# EasyEDA Pro project ACS DIN Switch.eprj

# Schematic Schematic1
Board Name: V3.0.0 Main Board; Create Date: 2026-03-01; Page Name: P1; Project Name: ACS DIN Switch; Schematic Name: Schematic1; Update Date: 2026-04-05; Company: EasyEDA.com; Page Size: A4; Version: V1.0
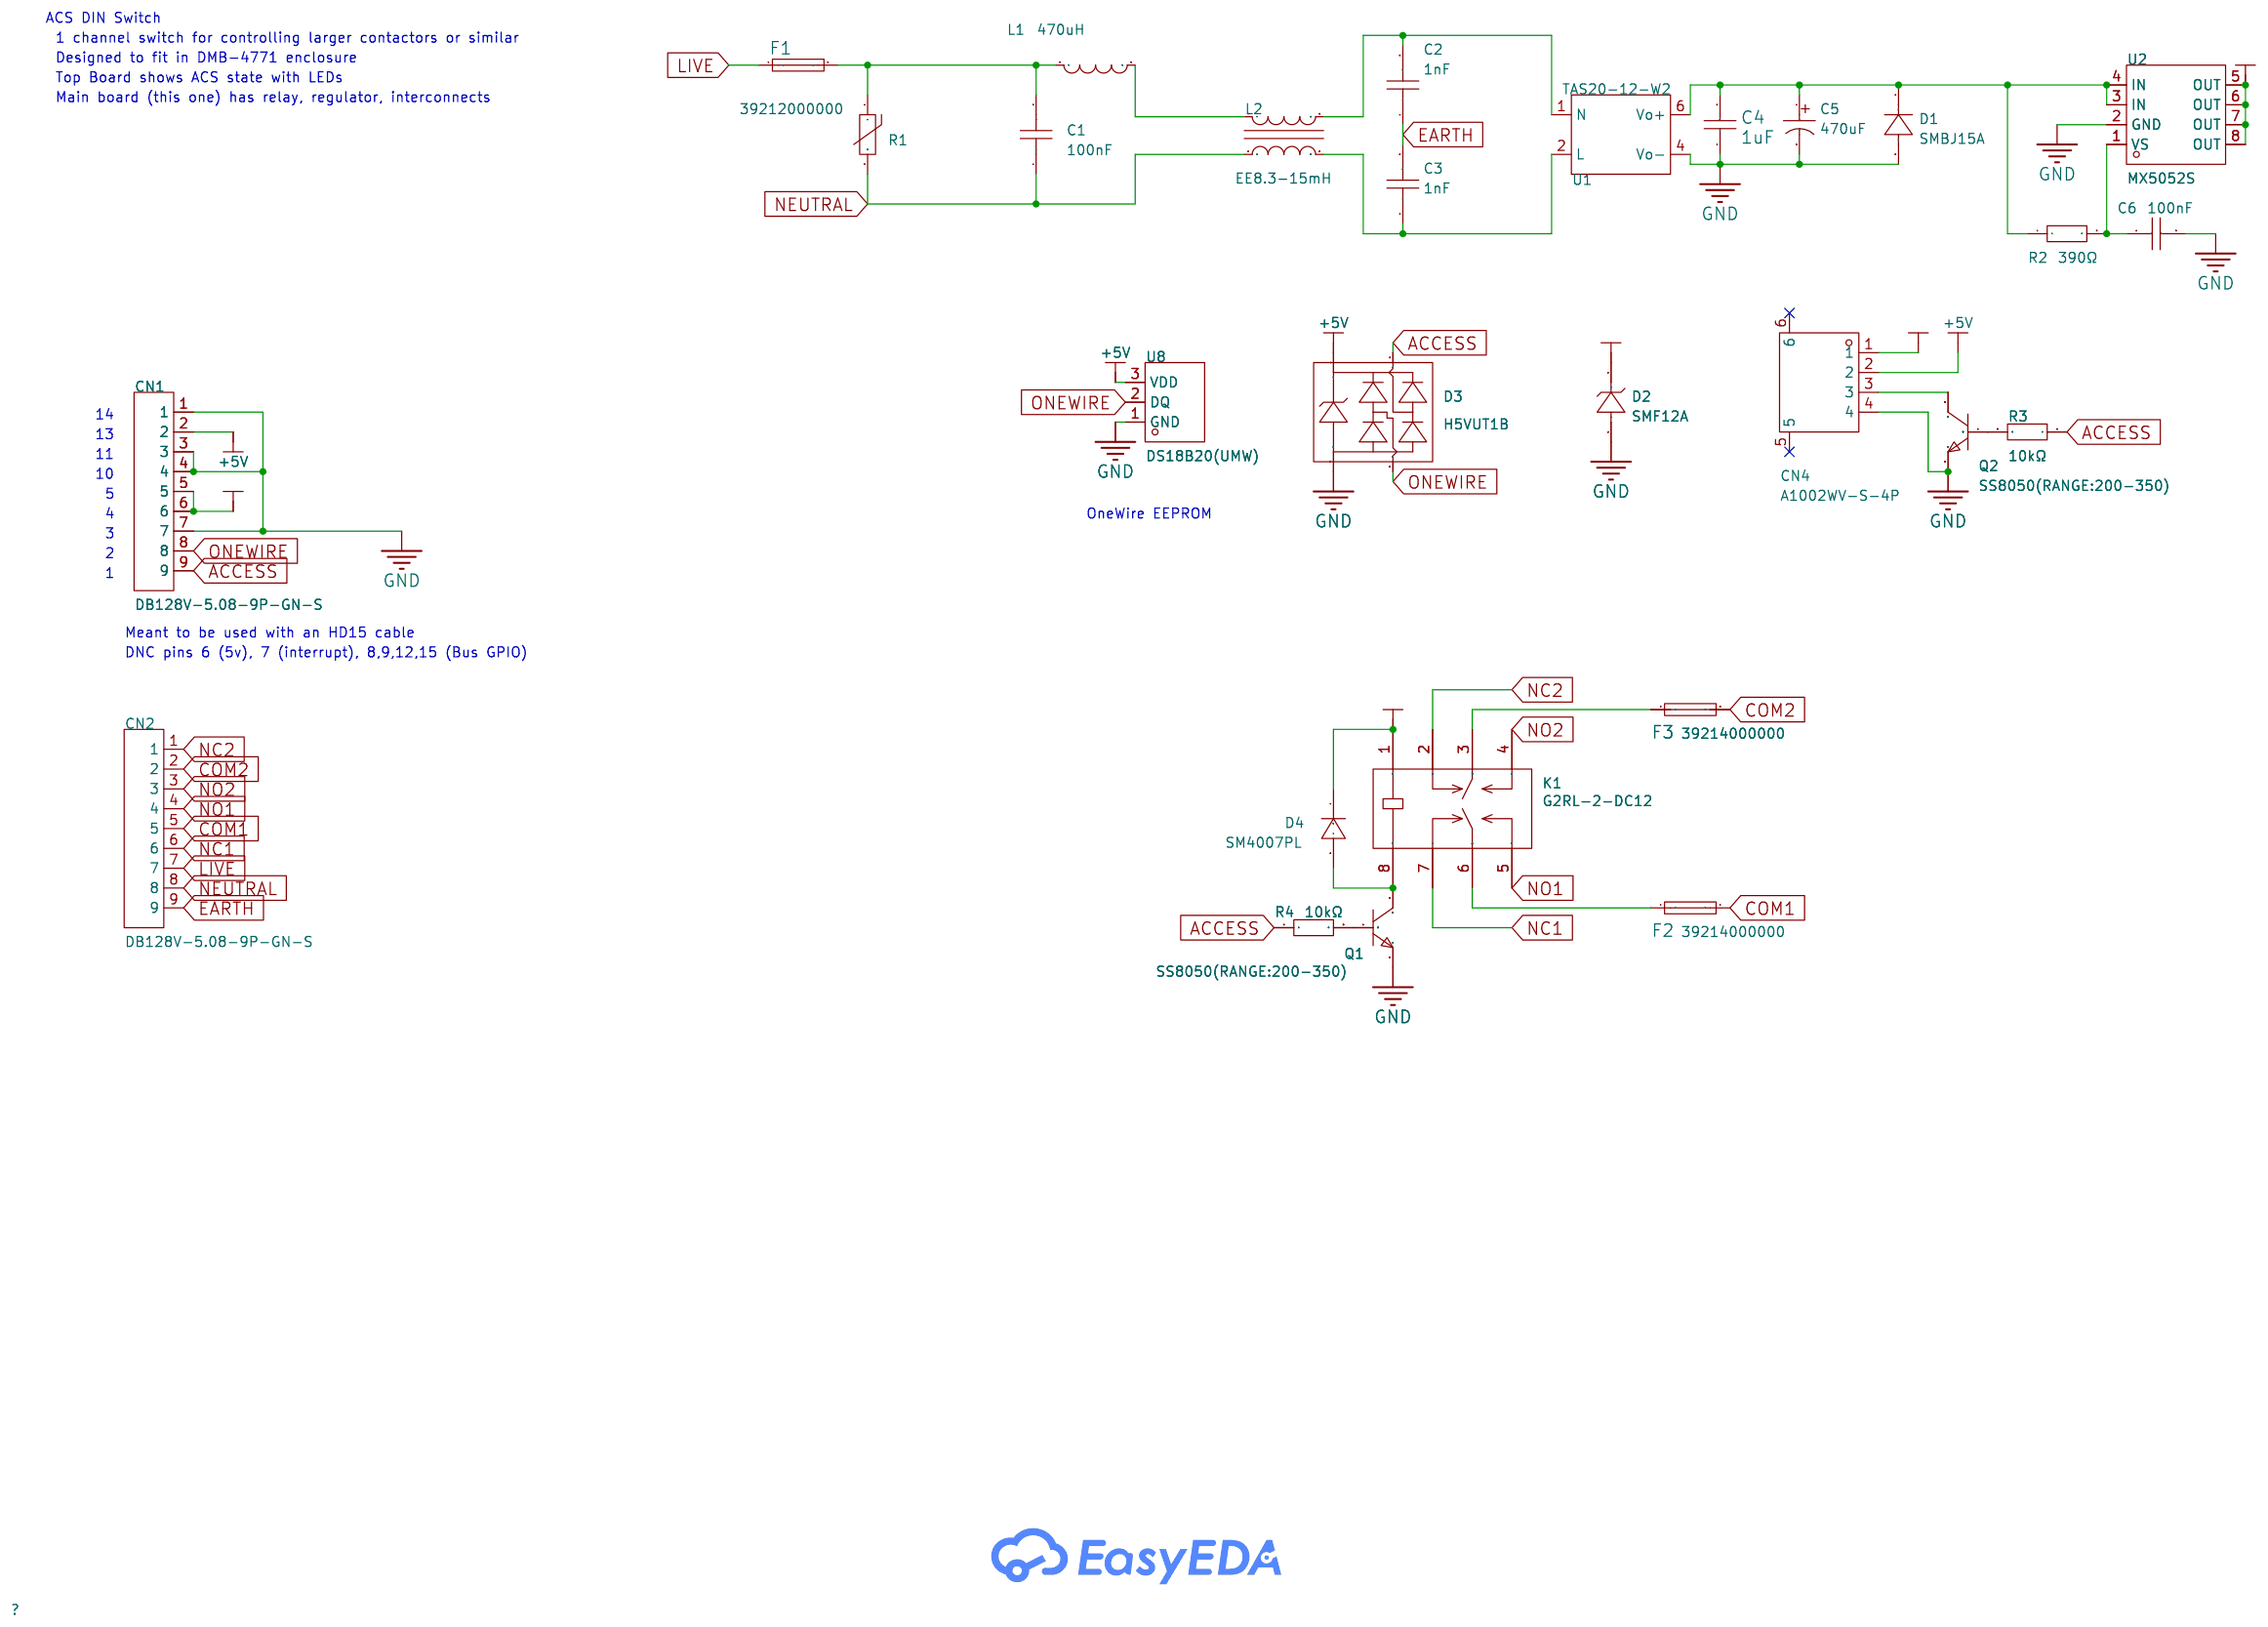
[diagram p0: schematic sheet]

## Parts
C1  100nF  [CAP-TH_L13.0-W6.0-P10.00-D1.0]
C2  1nF  [CAP-TH_L6.0-W3.5-P7.50-D1.0]
C3  1nF  [CAP-TH_L6.0-W3.5-P7.50-D1.0]
C4  1uF  [C0805]
C5  470uF  [CAP-TH_BD8.0-P3.50-D0.6-FD]
C6  100nF  [C0805]
CN1  DB128V-5.08-9P-GN-S  [CONN-TH_9P-P5.08_DIBO_DB128V-5.08-9P-GN-S]
CN2  DB128V-5.08-9P-GN-S  [CONN-TH_9P-P5.08_DIBO_DB128V-5.08-9P-GN-S]
CN4  A1002WV-S-4P  [CONN-SMD_A1002WV-S-4P]
D1  SMBJ15A  [SMB_L4.3-W3.6-LS5.3-RD]
D2  SMF12A  [SOD-123FL_L2.8-W1.8-LS3.8-R-RD]
D3  H5VUT1B  [SOT-143-4_L2.9-W1.3-P1.90-LS2.4-BL]
D4  SM4007PL  [SOD-123F_L2.8-W1.8-LS3.7-RD]
F1  39212000000  [FUSE-TH_L8.5-W4.0-P5.08-D0.6]
F2  39214000000  [FUSE-TH_L8.5-W4.0-P5.08-D0.6]
F3  39214000000  [FUSE-TH_L8.5-W4.0-P5.08-D0.6]
K1  G2RL-2-DC12  [RELAY-TH_G2RL-2]
L1  470uH  [IND-TH_BD8.7-P5.0-D0.7_RLB0914]
L2  EE8.3-15mH  [XFMR-TH_4P-L9.5-W9.5_EE8.3-10MH]
Q1  SS8050(RANGE:200-350)  [SOT-23-3_L2.9-W1.3-P1.90-LS2.4-BR]
Q2  SS8050(RANGE:200-350)  [SOT-23-3_L2.9-W1.3-P1.90-LS2.4-BR]
R1  210pF@1kHz  [RES-TH_L12.5-W5.1-P7.50-D1.2-S2.20]
R2  390Ω  [R0805]
R3  10kΩ  [R0805]
R4  10kΩ  [R0805]
U1  TAS20-12-W2  [PWRM-TH_4P-L39.0-W25.0_TAS12-15-W2]
U2  MX5052S  [SOP-8_L4.9-W3.9-P1.27-LS6.0-BL]
U8  DS18B20(UMW)  [TO-92-3_L4.9-W3.7-P1.27-L]

## Library data of the parts
C1 = MP2104K27C3X6LC: Capacitance:100nF Tolerance:±10% Tolerance:±10% Voltage(AC):275V Ratings:X2 safety certification:UL；ENEC；VDE；CQC；CSA; LCSC Part Name: 100nF ±10% 275V 等级:X2; Supplier Part: C105759; Manufacturer: SRD(圣融达); Supplier Footprint: 插件,P=10mm; JLCPCB Part Class: Extended Part; Datasheet: https://item.szlcsc.com/datasheet/MP2104K27C3X6LC/106974.html; Supplier: LCSC; Tolerance: ±10%; Voltage(AC): 275V; Ratings: X2; safety certification: UL；ENEC；VDE；CQC；CSA
C2 C3 = CT7-Y5Y5V1D102MSEW: LCSC Part Name: 1nF ±20% 400V 等级:Y1; Supplier Part: C278111; Manufacturer: FH(风华); Supplier Footprint: 插件,P=7.5mm; JLCPCB Part Class: Extended Part; Datasheet: https://item.szlcsc.com/datasheet/CT7-Y5Y5V1D102MSEW/265438.html; Supplier: LCSC; Tolerance: ±20%; Voltage(AC): 400V; Ratings: Y1; Operating Temperature: -25℃~+85℃
C4 = CL21B105KBFNNNE: Capacitance:1uF Tolerance:±10% Tolerance:±10% Voltage Rating:50V Temperature Coefficient:X7R; LCSC Part Name: 1uF ±10% 50V; Supplier Part: C28323; Manufacturer: SAMSUNG(三星); Supplier Footprint: 0805; Datasheet: https://item.szlcsc.com/datasheet/CL21B105KBFNNNE/29074.html; Supplier: LCSC; Tolerance: ±10%; Voltage Rating: 50V; Temperature Coefficient: X7R
C5 = GR477M025F12RR0VH4FP0: LCSC Part Name: 黑 470uF ±20% 25V; Supplier Part: C44602; Manufacturer: Chengx(承兴); Supplier Footprint: 插件,D8xL12mm; Datasheet: https://item.szlcsc.com/datasheet/GR477M025F12RR0VH4FP0/45604.html; Supplier: LCSC; Tolerance: ±20%; Voltage Rating: 25V; Pin Spacing: 3.5mm; Diameter: 8mm; Height - Seated (Max): 12mm; Lifetime: 3000hrs@105℃; Operating Temperature: -40℃~+105℃
C6 = CL21B104KCFNNNE: Capacitance:100nF Tolerance:±10% Tolerance:±10% Voltage Rating:100V Temperature Coefficient:X7R; LCSC Part Name: 100nF ±10% 100V; Supplier Part: C28233; Manufacturer: SAMSUNG(三星); Supplier Footprint: 0805; JLCPCB Part Class: Basic Part; Datasheet: https://item.szlcsc.com/datasheet/CL21B104KCFNNNE/28983.html; Supplier: LCSC; Tolerance: ±10%; Voltage Rating: 100V; Temperature Coefficient: X7R
CN1 CN2 = DB128V-5.08-9P-GN-S: LCSC Part Name: 1x9P 5.08mm 直插 排数:1 每排P数:9; Supplier Part: C2938972; Manufacturer: DORABO(地博电气); Supplier Footprint: 插件,P=5.08mm; JLCPCB Part Class: Extended Part; Datasheet: https://item.szlcsc.com/datasheet/DB128V-5.08-9P-GN-S/3298858.html; Supplier: LCSC; Number of Positions or Pins: 1x9P; Pitch: 5.08mm; Color: Green; Mounting Type: Through Hole; Number of Pins: 9P; Number of Rows: 1; Number of PINs Per Row: 9; Screw Specification: M2.5; Current Rating: 16A; Voltage Rating (Max): 300V; Wire Gauge - AWG: 12~22; Wire Gauge - mm2: 2.5; Operating Temperature: -40℃~+105℃
CN4 = A1002WV-S-4P: LCSC Part Name: 1x4P 间距:1mm 立贴 系列:SH; Supplier Part: C239513; Manufacturer: CJT(长江连接器); Supplier Footprint: SMD,P=1mm; JLCPCB Part Class: Extended Part; Datasheet: https://item.szlcsc.com/datasheet/A1002WV-S-4P/238617.html; Supplier: LCSC; Pins Structure: 1x4P; Pitch: 1mm; Mounting Type: Surface Mount,Vertical; Reference Series: SH; Number of Pins: 4P; Number of Rows: 1; Number of PINs Per Row: 4; Current Rating: 1A; Contact Material: Phosphor Bronze; Contact Plating: Tin; Operating Temperature: -40℃~+105℃; Voltage Rating: 50V; Plastic Material: LCP; Flame Retardant Rating: UL94V-0
D1 = SMBJ15A_C19077569: Polarity:Unidirectional Reverse Stand-Off Voltage (Vrwm):15V Clamping Voltage:24.4V Peak Pulse Current (Ipp):24.59A@10/1000us Peak Pulse Power Dissipation (Ppp):600W@10/1000us Voltage - Breakdown:18.5V Reverse Leakage Current (Ir):5uA Operating Temperatur; LCSC Part Name: 单向TVS 15V截止 峰值浪涌电流：24.59A@10/1000us; Supplier Part: C19077569; Manufacturer: R+O(宏嘉诚); Supplier Footprint: DO-214AA(SMB); JLCPCB Part Class: Extended Part; Datasheet: https://item.szlcsc.com/datasheet/SMBJ15A/20275654.html; Supplier: LCSC; Polarity: Unidirectional; Reverse Stand-Off Voltage (Vrwm): 15V; Clamping Voltage: 24.4V; Peak Pulse Current (Ipp): 24.59A@10/1000us; Peak Pulse Power Dissipation (Ppp): 600W@10/1000us; Voltage - Breakdown: 18.5V; Reverse Leakage Current (Ir): 5uA; Operating Temperature: -55℃~+150℃; level of protection: IEC 61000-4-2; Type: TVS
D2 = SMF12A_C19077506: Polarity:Unidirectional Reverse Stand-Off Voltage (Vrwm):12V Clamping Voltage:19.9V Peak Pulse Current (Ipp):10.1A@10/1000us Peak Pulse Power Dissipation (Ppp):200W@10/1000us Voltage - Breakdown:14.7V Reverse Leakage Current (Ir):2.5uA Operating Temperatu; LCSC Part Name: 单向TVS 12V截止 峰值浪涌电流：10.1A@10/1000us; Supplier Part: C19077506; Manufacturer: R+O(宏嘉诚); Supplier Footprint: SOD-123FL; JLCPCB Part Class: Extended Part; Datasheet: https://item.szlcsc.com/datasheet/SMF12A/20275591.html; Supplier: LCSC; Polarity: Unidirectional; Reverse Stand-Off Voltage (Vrwm): 12V; Clamping Voltage: 19.9V; Peak Pulse Current (Ipp): 10.1A@10/1000us; Peak Pulse Power Dissipation (Ppp): 200W@10/1000us; Voltage - Breakdown: 14.7V; Reverse Leakage Current (Ir): 2.5uA; Operating Temperature: -55℃~+150℃; level of protection: IEC 61000-4-2; Type: TVS
D3 = H5VUT1B: LCSC Part Name: 丝印:ER5 双向ESD 5V截止 峰值浪涌电流：5A@8/20us; Supplier Part: C22395520; Manufacturer: R+O(宏嘉诚); Supplier Footprint: SOT-143; JLCPCB Part Class: Extended Part; Datasheet: https://item.szlcsc.com/datasheet/H5VUT1B/23994517.html; Supplier: LCSC; Polarity: Bidirectional; Reverse Stand-Off Voltage (Vrwm): 5V; Clamping Voltage: 15V; Peak Pulse Current (Ipp): 5A@8/20us; Peak Pulse Power Dissipation (Ppp): 75W@8/20us; Voltage - Breakdown: 6V; Reverse Leakage Current (Ir): 500nA; Operating Temperature: -55℃~+125℃; level of protection: IEC 61000-4-5；IEC 61000-4-2; Type: ESD; Junction Capacitance: 0.6pF；0.3pF
D4 = SM4007PL_C64898: LCSC Part Name: 1kV 1A; Supplier Part: C64898; Manufacturer: MDD(辰达半导体); Supplier Footprint: SOD-123FL; JLCPCB Part Class: Basic Part; Datasheet: https://item.szlcsc.com/datasheet/SM4007PL/65968.html; Supplier: LCSC; Diode Configuration: Independent; Voltage - Forward(Vf@If): 1.1V@1A; Voltage - DC Reverse(Vr): 1kV; Current - Rectified: 1A; Reverse Leakage Current (Ir): 10uA@1kV; Non-Repetitive Peak Forward Surge Current: 25A; Operating Junction Temperature Range: -55℃~+150℃
F1 = 39212000000: LCSC Part Name: 插件式保险丝; Supplier Part: C142678; Manufacturer: Littelfuse(美国力特); Supplier Footprint: 插件,P=5.08mm; JLCPCB Part Class: Extended Part; Datasheet: https://item.szlcsc.com/datasheet/39212000000/154009.html; Supplier: LCSC; Current Rating: 2A; Operating Temperature: -40℃~+85℃; Interrupt Rating: 25A
F2 F3 = 39214000000: LCSC Part Name: 插件式保险丝; Supplier Part: C142709; Manufacturer: Littelfuse(美国力特); Supplier Footprint: 插件,P=5.08mm; JLCPCB Part Class: Extended Part; Datasheet: https://item.szlcsc.com/datasheet/39214000000/154040.html; Supplier: LCSC; Current Rating: 4A; Voltage Rating (DC): 250V; Operating Temperature: -40℃~+125℃; Melting I2t: 126.4; Interrupt Rating: 40A; Pitch: 5.08mm
K1 = G2RL-2-DC12: LCSC Part Name: PCB功率继电器; Supplier Part: C61458; Manufacturer: OMRON(欧姆龙); Supplier Footprint: DIP,12.5x28.8mm; JLCPCB Part Class: Extended Part; Datasheet: https://item.szlcsc.com/datasheet/G2RL-2-DC12/62511.html; Supplier: LCSC
L1 = RLB0914-471KL: Inductance:470uH Tolerance:±10% Tolerance:±10% Current Rating:560mA Current - Saturation(Isat):1A DC Resistance(DCR):1.3Ω; LCSC Part Name: 470uH ±10% 1A; Supplier Part: C7051049; Manufacturer: BOURNS; Supplier Footprint: 插件,D=8.7mm; Datasheet: https://item.szlcsc.com/datasheet/RLB0914-471KL/8017672.html; Supplier: LCSC; Tolerance: ±10%; Current Rating: 560mA; Current - Saturation(Isat): 1A; DC Resistance(DCR): 1.3Ω
L2 = EE8.3-15mH: LCSC Part Name: 共模滤波器; Supplier Part: C18870246; Manufacturer: NYBOXING(尼博星); Supplier Footprint: 插件; JLCPCB Part Class: Extended Part; Datasheet: https://item.szlcsc.com/datasheet/EE8.3-15mH/20064822.html; Supplier: LCSC; Inductance @ Frequency: 15mH@10kHz; Current Rating: 180mA; Voltage Withstand: 1.5kV; DC Resistance(DCR): 5Ω; Operating Temperature: -40℃~+125℃; Insulation Resistance(IR): 100MΩ
Q1 Q2 = SS8050(RANGE:200-350)_C2150: LCSC Part Name: hfe=200~350 NPN 电流:1.5A 电压:25V; Supplier Part: C2150; Manufacturer: CJ(江苏长电/长晶); Supplier Footprint: SOT-23; Datasheet: https://item.szlcsc.com/datasheet/SS8050(RANGE%253A200-350)/2507.html; Supplier: LCSC; type: NPN; Current - Collector(Ic): 1.5A; Collector - Emitter Voltage VCEO: 25V; Pd - Power Dissipation: 300mW; DC Current Gain: 200@800mA,1V; Transition frequency(fT): 100MHz; Current - Collector Cutoff: 100nA; Vce Saturation(VCE(sat)): 500mV@800mA,80mA; Operating Temperature: -55℃~+150℃; Emitter-Base Voltage(Vebo): 5V; Number: 1 NPN
R1 = VDR-10D471K: Varistor Voltage:423V~517V Varistor Voltage:423V~517V Clamping Voltage:775V Maximum DC Volts:385V Maximum AC Volts:300V Peak Current:2.5kA Energy:67J Energy:67J Capacitance:210pF@1kHz Rated Wattage:400mW; LCSC Part Name: 钳位电压775V 67焦耳 插件压敏电阻; Supplier Part: C316609; Manufacturer: VDR(嵩隆); Supplier Footprint: 插件,P=7.5mm; JLCPCB Part Class: Extended Part; Datasheet: https://item.szlcsc.com/datasheet/VDR-10D471K/298277.html; Supplier: LCSC; Varistor Voltage: 423V~517V; Clamping Voltage: 775V; Maximum DC Volts: 385V; Maximum AC Volts: 300V; Peak Current: 2.5kA; Energy: 67J; Rated Wattage: 400mW
R2 = 0805W8F3900T5E: Type:Thick Film Resistor Resistance:390Ω Tolerance:±1% Tolerance:±1% Power(Watts):125mW Voltage-Supply(Max):150V Temperature Coefficient:±100ppm/℃ Temperature Coefficient:±100ppm/℃ Operating Temperature:-55℃~+155℃ Operating Temperature:-55℃~+155℃; LCSC Part Name: 390Ω ±1% 125mW 厚膜电阻; Supplier Part: C17655; Manufacturer: UNI-ROYAL(厚声); Supplier Footprint: 0805; Datasheet: https://item.szlcsc.com/datasheet/0805W8F3900T5E/18343.html; Supplier: LCSC; Type: Thick Film Resistor; Tolerance: ±1%; Power(Watts): 125mW; Voltage-Supply(Max): 150V; Temperature Coefficient: ±100ppm/℃; Operating Temperature: -55℃~+155℃
R3 R4 = 0805W8F1002T5E: LCSC Part Name: 10kΩ ±1% 125mW 厚膜电阻; Supplier Part: C17414; Manufacturer: UNI-ROYAL(厚声); Supplier Footprint: 0805; JLCPCB Part Class: Basic Part; Datasheet: https://item.szlcsc.com/datasheet/0805W8F1002T5E/18102.html; Supplier: LCSC; Type: Thick Film Resistor; Tolerance: ±1%; Power(Watts): 125mW; Voltage-Supply(Max): 150V; Temperature Coefficient: ±100ppm/℃; Operating Temperature: -55℃~+155℃
U1 = TAS20-12-W2: Conversion Type:AC/DC-DC Number of Outputs:1 Voltage - Input(DC):100V~370V Voltage - Input(DC):100V~370V Voltage - Input(AC):85VAC~265VAC Voltage - Input(AC):85VAC~265VAC Output Voltage:12V Output Voltage:12V Output Voltage Accuracy:±2% Output Voltage Acc; LCSC Part Name: 小体积AC-DC电源模块; Supplier Part: C39846906; Manufacturer: TDPOWER(腾达电源); Supplier Footprint: 插件,39x25mm; Datasheet: https://item.szlcsc.com/datasheet/TAS20-12-W2/41578643.html; Supplier: LCSC; Conversion Type: AC/DC-DC; Number of Outputs: 1; Voltage - Input(DC): 100V~370V; Voltage - Input(AC): 85VAC~265VAC; Output Voltage: 12V; Output Voltage Accuracy: ±2%; Output Current(Max): 1.67A; Output Power: 20W; Quiescent Dissipation: 0.15W; Conversion Efficiency: 88%; Ripple Noise: 100mVp-p; Capacitive Load(Max): 3300uF; Features: Over Current Protection；Short Circuit Protection; Isolation Voltage(Vrms): 2.5kV; Length: 39mm; Width: 25mm; Height: 21mm; Switching Frequency: 100kHz
U2 = MX5052S: LCSC Part Name: 集成MOS Oring控制器; Supplier Part: C5875696; Manufacturer: Wuxi Maxinmicro(无锡明芯微); Supplier Footprint: SOP-8; JLCPCB Part Class: Extended Part; Datasheet: https://item.szlcsc.com/datasheet/MX5052S/6809525.html; Supplier: LCSC
U8 = DS18B20(UMW): LCSC Part Name: DS18B20; Supplier Part: C376006; Manufacturer: UMW(友台半导体); Supplier Footprint: TO-92; JLCPCB Part Class: Extended Part; Datasheet: https://item.szlcsc.com/datasheet/DS18B20(UMW)/348632.html; Supplier: LCSC; Detection Temperature Range: -55℃~+125℃; Tolerance: ±0.4℃; Voltage - Supply: 3V~5.5V; Interface: Single-bus; Temperature Conversion Time: 750ms; Temperature Resolution: 12bit

## Nets
+5V: CN1.2 CN4.2 D3.4 U8.3(VDD)
+12V: CN1.5 CN1.6 CN4.1 D2.2(K) D4.1(C) K1.1 U2.5(OUT) U2.6(OUT) U2.7(OUT) U2.8(OUT)
GND: C4.1 C5.2 C6.2 CN1.1 CN1.3 CN1.4 CN1.7 CN4.4 D1.2(A) D2.1(A) D3.1 Q1.2(E) Q2.2(E) U1.4(Vo-) U2.2(GND) U8.1(GND)
ACCESS: CN1.9 D3.3 R3.1 R4.1
COM1: CN2.5 F2.2
COM2: CN2.2 F3.2
EARTH: C2.1 C3.2 CN2.9
LIVE: CN2.7 F1.1
NC1: CN2.6 K1.7
NC2: CN2.1 K1.2
NEUTRAL: C1.1 CN2.8 L2.1 R1.2
NO1: CN2.4 K1.5
NO2: CN2.3 K1.4
ONEWIRE: CN1.8 D3.2 U8.2(DQ)
$1N1976: C4.2 C5.1 D1.1(K) R2.1 U1.6(Vo+) U2.3(IN) U2.4(IN)
$1N1978: C2.2 L2.3 U1.1(N)
$1N1980: C6.1 R2.2 U2.1(VS)
$1N1987: C3.1 L2.2 U1.2(L)
$1N3331: D4.2(A) K1.8 Q1.3(C)
$1N4248: Q2.1(B) R3.2
$1N4287: Q1.1(B) R4.2
$1N4344: CN4.3 Q2.3(C)
$1N5641: F2.1 K1.6
$1N5654: F3.1 K1.3
$1N6319: C1.2 F1.2 L1.1 R1.1
$1N6320: L1.2 L2.4

Not connected (* = marked no-connect by the designer): CN4 5* 6*

## Notes on the sheet
- ACS DIN Switch
- 1 channel switch for controlling larger contactors or similar
- Designed to fit in DMB-4771 enclosure
- Top Board shows ACS state with LEDs
- Main board (this one) has relay, regulator, interconnects
- 14
- 13
- 11
- 10
- 5
- 3
- 4
- OneWire EEPROM
- 2
- 1
- Meant to be used with an HD15 cable
- DNC pins 6 (5v), 7 (interrupt), 8,9,12,15 (Bus GPIO)

# Schematic Schematic2
Board Name: V3.0.0 Top Board; Create Date: 2026-03-02; Page Name: P1; Project Name: ACS DIN Switch; Schematic Name: Schematic2; Update Date: 2026-03-01; Company: EasyEDA.com; Page Size: A4; Version: V1.0
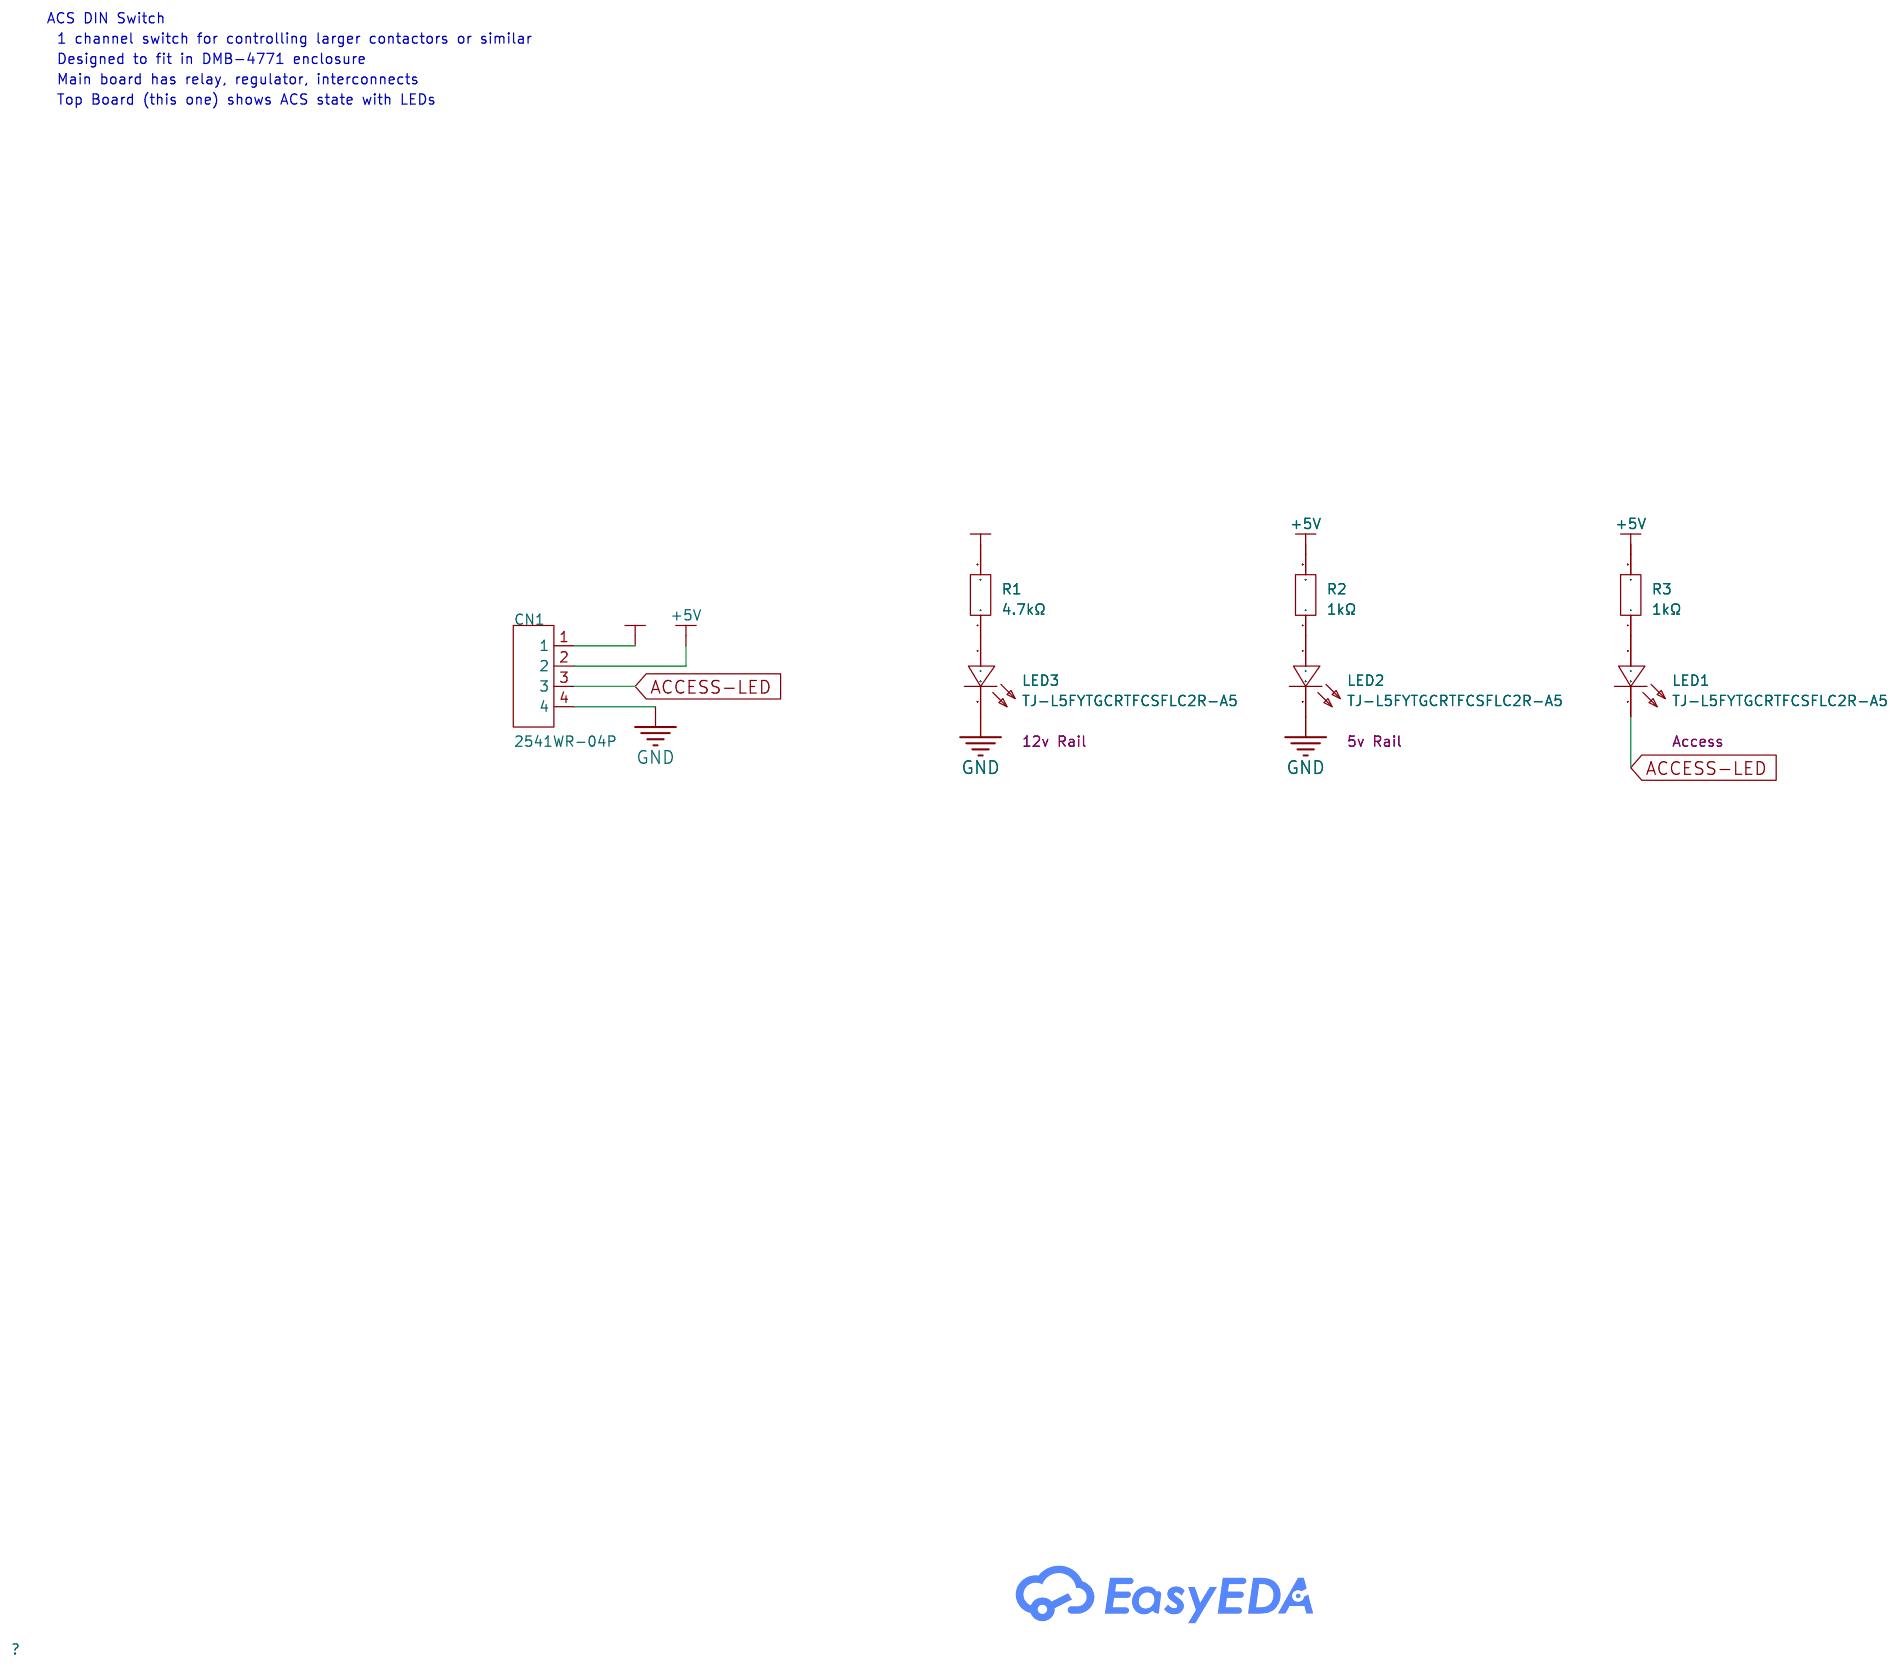
[diagram p1: schematic sheet]

## Parts
CN1  2541WR-04P  [HDR-TH_4P-P2.54-H-M-W10.4-N]
LED1  TJ-L5FYTGCRTFCSFLC2R-A5  [LED-TH_BD5.8-P2.54-FD]
LED2  TJ-L5FYTGCRTFCSFLC2R-A5  [LED-TH_BD5.8-P2.54-FD]
LED3  TJ-L5FYTGCRTFCSFLC2R-A5  [LED-TH_BD5.8-P2.54-FD]
R1  4.7kΩ  [RES-TH_BD2.2-L6.5-P10.50-D0.6]
R2  1kΩ  [RES-TH_BD2.2-L6.5-P10.50-D0.6]
R3  1kΩ  [RES-TH_BD2.2-L6.5-P10.50-D0.6]

## Library data of the parts
CN1 = 2541WR-04P: LCSC Part Name: 1x4P 间距:2.54mm 方针 弯插; Supplier Part: C5383097; Manufacturer: HanElectricity(瀚源); Supplier Footprint: 弯插,P=2.54mm; JLCPCB Part Class: Extended Part; Datasheet: https://item.szlcsc.com/datasheet/2541WR-04P/6258457.html; Supplier: LCSC; Pin Structure: 1x4P; Pitch: 2.54mm; Circluar Pins/Square Pins: Pin Header; Mounting Type: Right Angle; Number of Rows: 1; Number of Pins: 4P; Current Rating: 3A; Length of Mating Pin: 6mm; Insulation Height: 2.54mm; Contact Material: Brass; Contact Plating: Gold; Operating Temperature: -40℃~+105℃; Color: Black
LED1 = TJ-L5FYTGCRTFCSFLC2R-A5: Lamp Holder Type:5mm Round Lens Illumination Color:Red Voltage - Forward(Vf):1.8V~2.6V Voltage - Forward(Vf):1.8V~2.6V Power(Watts):72mW Forward Current:20mA Wavelength - Dominant:620nm~630nm Wavelength - Dominant:620nm~630nm Peak Wavelength:630nm Lens Co; LCSC Part Name: 红灯; Supplier Part: C331032; Manufacturer: TOGIALED(统佳); Supplier Footprint: 插件,D=5mm; Datasheet: https://item.szlcsc.com/datasheet/TJ-L5FYTGCRTFCSFLC2R-A5/310401.html; Supplier: LCSC; Lamp Holder Type: 5mm Round Lens; Illumination Color: Red; Voltage - Forward(Vf): 1.8V~2.6V; Power(Watts): 72mW; Forward Current: 20mA; Wavelength - Dominant: 620nm~630nm; Peak Wavelength: 630nm; Lens Color: Water Clear; Luminous Intensity: 5000mcd; Viewing Angle: 30°; Operating Temperature: -20℃~+80℃; Note: Access
LED2 = TJ-L5FYTGCRTFCSFLC2R-A5: Lamp Holder Type:5mm Round Lens Illumination Color:Red Voltage - Forward(Vf):1.8V~2.6V Voltage - Forward(Vf):1.8V~2.6V Power(Watts):72mW Forward Current:20mA Wavelength - Dominant:620nm~630nm Wavelength - Dominant:620nm~630nm Peak Wavelength:630nm Lens Co; LCSC Part Name: 红灯; Supplier Part: C331032; Manufacturer: TOGIALED(统佳); Supplier Footprint: 插件,D=5mm; Datasheet: https://item.szlcsc.com/datasheet/TJ-L5FYTGCRTFCSFLC2R-A5/310401.html; Supplier: LCSC; Lamp Holder Type: 5mm Round Lens; Illumination Color: Red; Voltage - Forward(Vf): 1.8V~2.6V; Power(Watts): 72mW; Forward Current: 20mA; Wavelength - Dominant: 620nm~630nm; Peak Wavelength: 630nm; Lens Color: Water Clear; Luminous Intensity: 5000mcd; Viewing Angle: 30°; Operating Temperature: -20℃~+80℃; Note: 5v Rail
LED3 = TJ-L5FYTGCRTFCSFLC2R-A5: Lamp Holder Type:5mm Round Lens Illumination Color:Red Voltage - Forward(Vf):1.8V~2.6V Voltage - Forward(Vf):1.8V~2.6V Power(Watts):72mW Forward Current:20mA Wavelength - Dominant:620nm~630nm Wavelength - Dominant:620nm~630nm Peak Wavelength:630nm Lens Co; LCSC Part Name: 红灯; Supplier Part: C331032; Manufacturer: TOGIALED(统佳); Supplier Footprint: 插件,D=5mm; Datasheet: https://item.szlcsc.com/datasheet/TJ-L5FYTGCRTFCSFLC2R-A5/310401.html; Supplier: LCSC; Lamp Holder Type: 5mm Round Lens; Illumination Color: Red; Voltage - Forward(Vf): 1.8V~2.6V; Power(Watts): 72mW; Forward Current: 20mA; Wavelength - Dominant: 620nm~630nm; Peak Wavelength: 630nm; Lens Color: Water Clear; Luminous Intensity: 5000mcd; Viewing Angle: 30°; Operating Temperature: -20℃~+80℃; Note: 12v Rail
R1 = MF0W4FF4701A50: Supplier Part: C20625253; Manufacturer: UNI-ROYAL(厚声); Supplier Footprint: DIP; Datasheet: https://item.szlcsc.com/datasheet/MF0W4FF4701A50/22028746.html; Supplier: LCSC; Type: Metal Film Resistor; Tolerance: ±1%; Power(Watts): 250mW; Temperature Coefficient: ±50ppm/℃
R2 R3 = MF0W4FF1001A50: LCSC Part Name: 金属膜电阻 1kΩ ±1% 250mW; Supplier Part: C20625214; Manufacturer: UNI-ROYAL(厚声); Supplier Footprint: 插件,D2.2xL6.5mm; Datasheet: https://item.szlcsc.com/datasheet/MF0W4FF1001A50/22028707.html; Supplier: LCSC; Type: Metal Film Resistor; Tolerance: ±1%; Power(Watts): 250mW; Temperature Coefficient: ±50ppm/℃

## Nets
+5V: CN1.2 R2.2 R3.2
+12V: CN1.1 R1.2
GND: CN1.4 LED2.2(C) LED3.2(C)
ACCESS-LED: CN1.3 LED1.2(C)
$1N574: LED3.1(A) R1.1
$1N582: LED2.1(A) R2.1
$1N622: LED1.1(A) R3.1

## Notes on the sheet
- ACS DIN Switch
- 1 channel switch for controlling larger contactors or similar
- Designed to fit in DMB-4771 enclosure
- Main board has relay, regulator, interconnects
- Top Board (this one) shows ACS state with LEDs

# Board PCB1
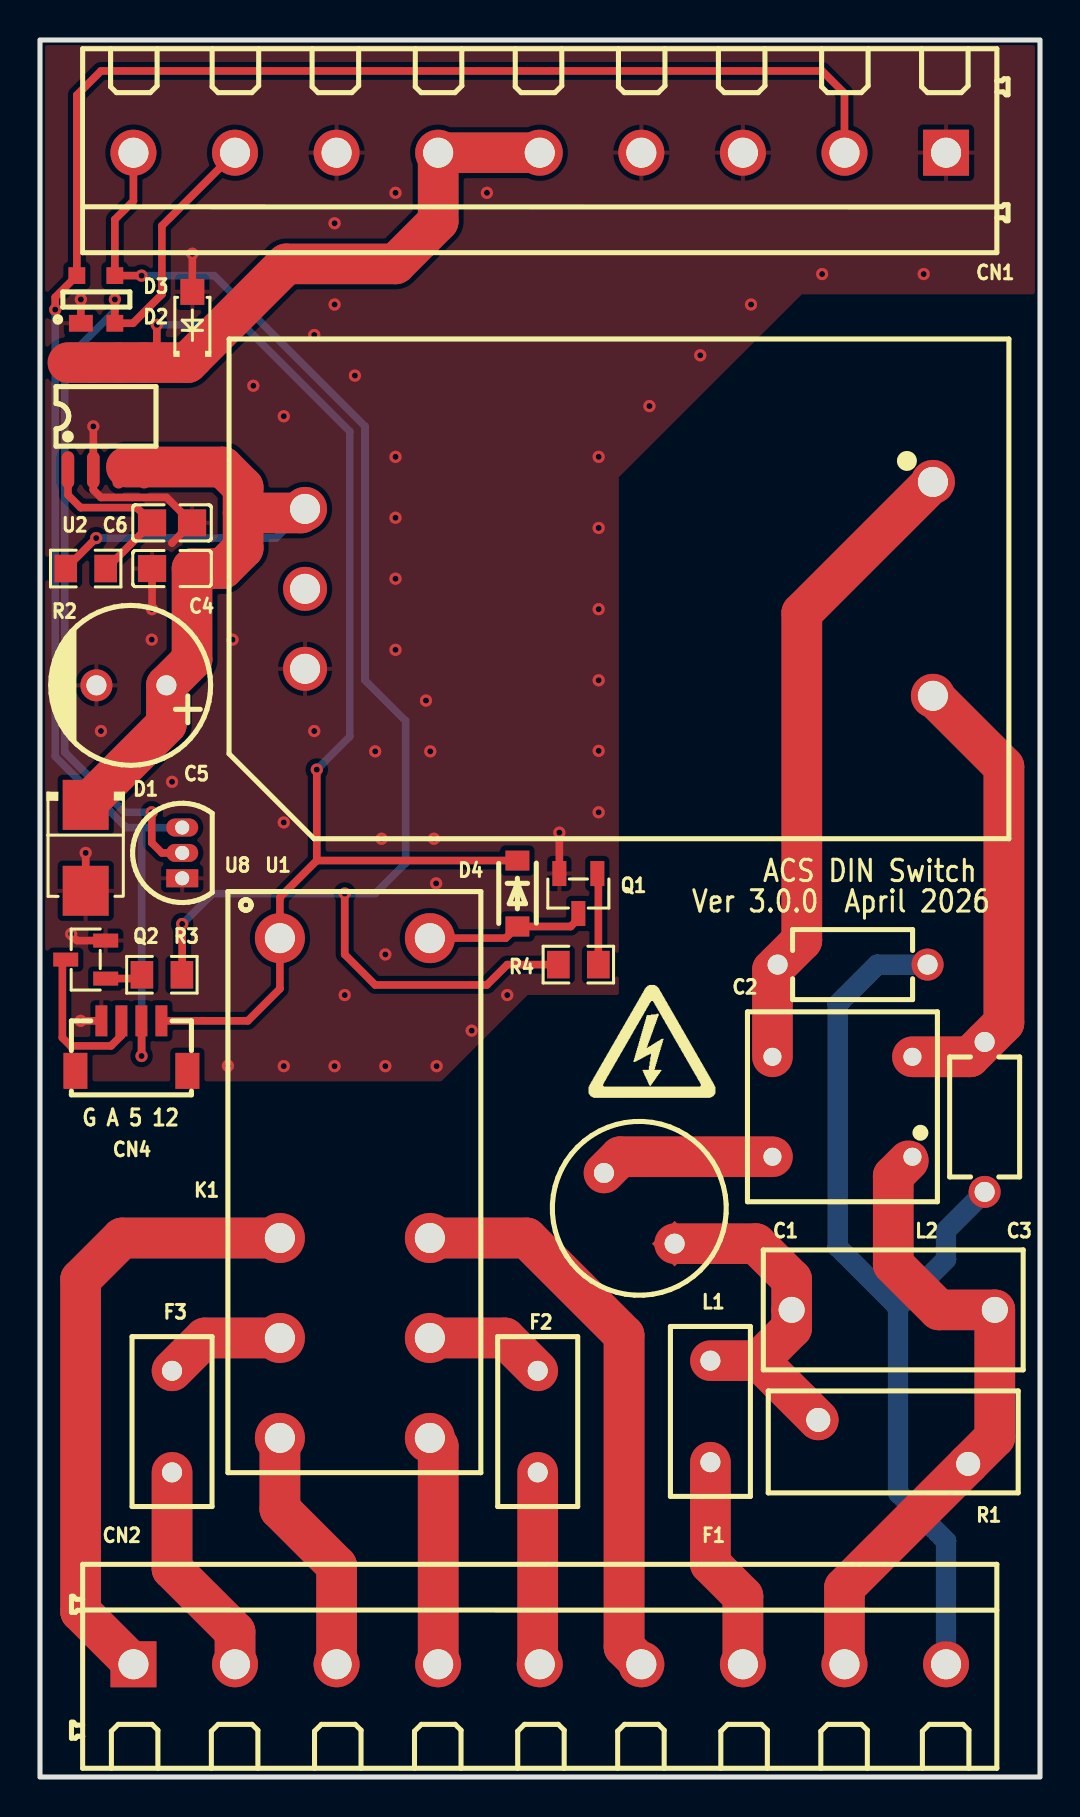
[diagram p2: board, top side]
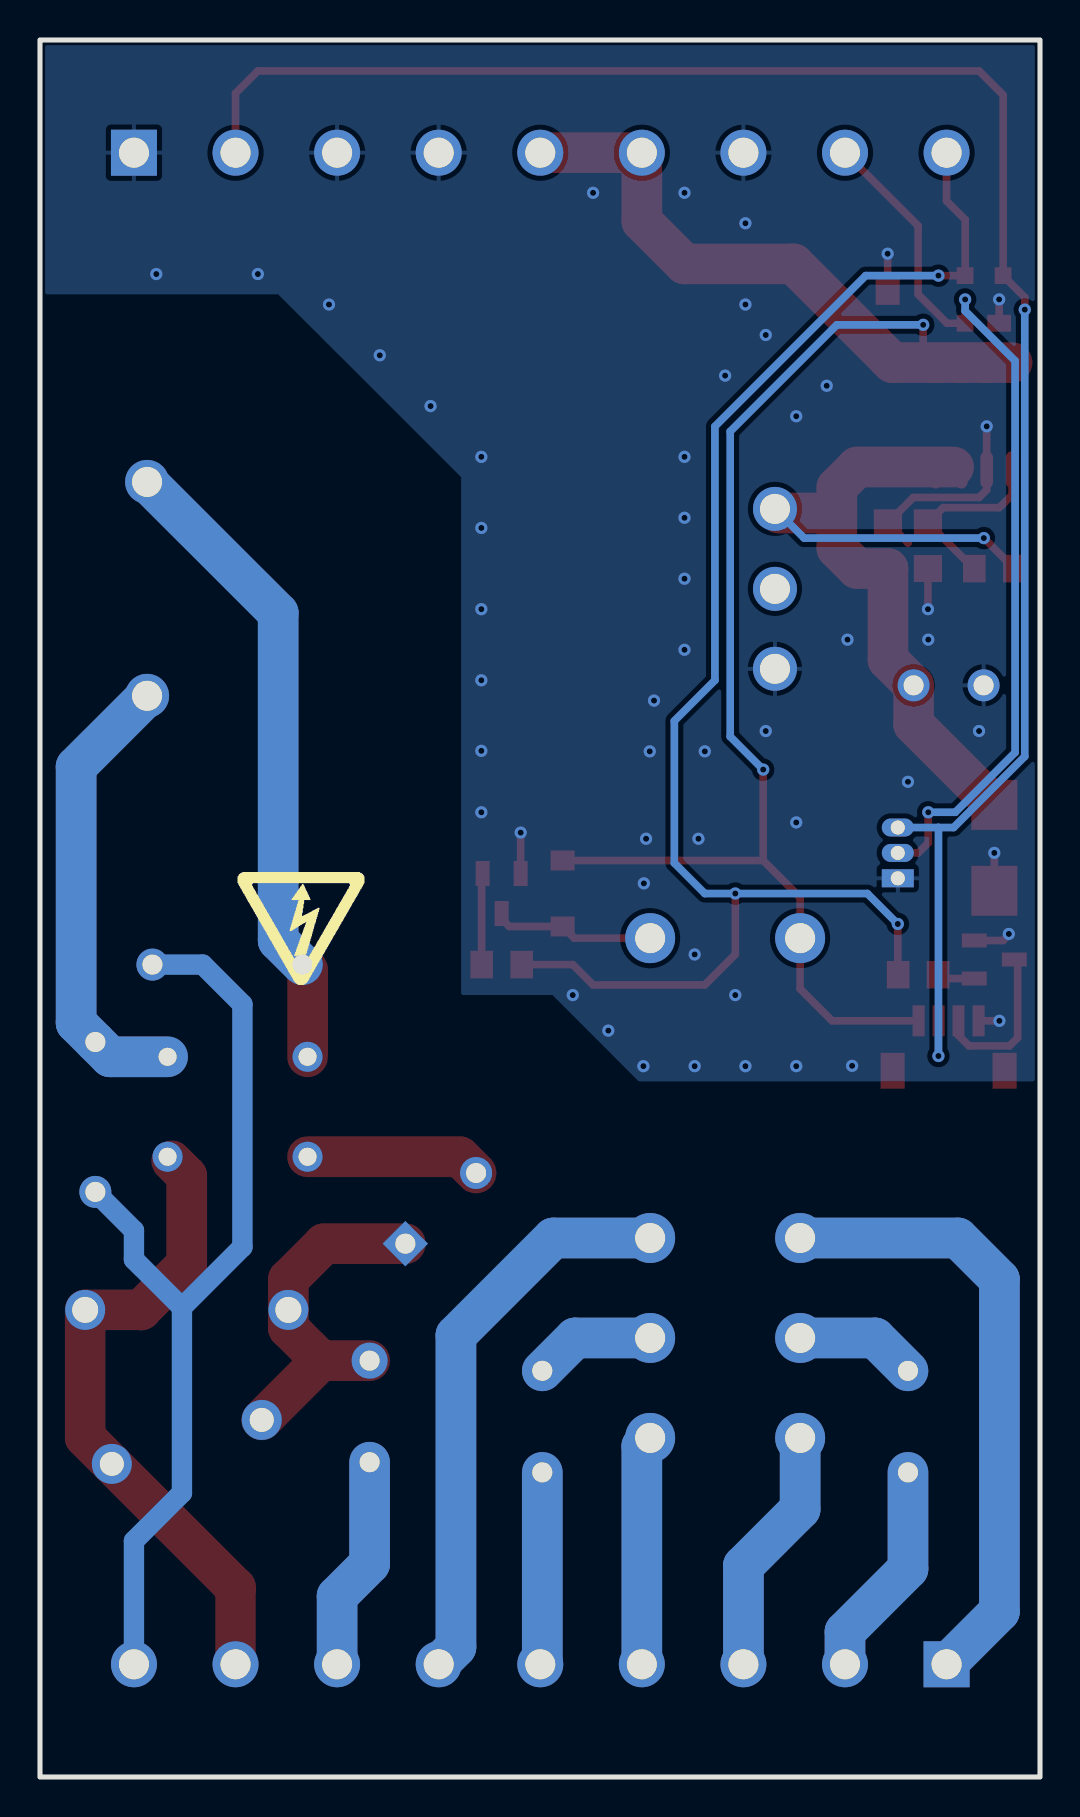
[diagram p3: board, bottom side, seen from below]

Outline 50.01 x 86.89 mm; copper layers: Top Layer, Bottom Layer. Coordinates in mm from the lower left corner of the outline.
Outline path: rectangle 0,86.89 50.01,0
Stack: Top Layer 0.035mm / Dielectric1 1.51mm FR4 er 4.5 / Bottom Layer 0.035mm

## Design rules (mm)
template: Custom Config
spacing copperThickness1oz (default): track to track 0.102, other pairs 0.152 to 0.3
spacing copperThickness2oz: track to track 0.203, other pairs 0.152 to 0.3
spacing HV Spacing: track to track 2, other pairs 0.152 to 2
track width copperThickness1oz (default): min 0.127, default 0.254, max 2.54
track width copperThickness2oz: min 0.203, default 0.254, max 2.54
differential pair differentialPair (default): width min 0.127, default 0.254, max 2.54; gap min 0.152, default 0.152
via viaSize (default): diameter min 0.5, default 0.61, max 10; hole min 0.3, default 0.305, max 6.3
net NEUTRAL uses HV Spacing
net EARTH uses HV Spacing
net LIVE uses HV Spacing
net $1N1987 uses HV Spacing
net $1N1978 uses HV Spacing
net NC2 uses HV Spacing
net COM2 uses HV Spacing
net NO2 uses HV Spacing
net NO1 uses HV Spacing
net NC1 uses HV Spacing
net COM1 uses HV Spacing
net $1N6319 uses HV Spacing
net $1N6320 uses HV Spacing

## Placement (name value [footprint] x y rotation side)
C1  100nF  [CAP-TH_L13.0-W6.0-P10.00-D1.0]  42.67 23.37 180 top
C2  1nF  [CAP-TH_L6.0-W3.5-P7.50-D1.0]  40.64 40.64 180 top
C3  1nF  [CAP-TH_L6.0-W3.5-P7.50-D1.0]  47.24 33.02 270 top
C4  1uF  [C0805]  6.6 60.45 0 top
C5  470uF  [CAP-TH_BD8.0-P3.50-D0.6-FD]  4.57 54.61 180 top
C6  100nF  [C0805]  6.6 62.74 0 top
CN1  DB128V-5.08-9P-GN-S  [CONN-TH_9P-P5.08_DIBO_DB128V-5.08-9P-GN-S]  24.99 81.25 180 top
CN2  DB128V-5.08-9P-GN-S  [CONN-TH_9P-P5.08_DIBO_DB128V-5.08-9P-GN-S]  24.99 5.64 0 top
CN4  A1002WV-S-4P  [CONN-SMD_A1002WV-S-4P]  4.57 36.58 0 top
D1  SMBJ15A  [SMB_L4.3-W3.6-LS5.3-RD]  2.29 46.48 270 top
D2  SMF12A  [SOD-123FL_L2.8-W1.8-LS3.8-R-RD]  7.62 72.64 90 top
D3  H5VUT1B  [SOT-143-4_L2.9-W1.3-P1.90-LS2.4-BL]  2.79 73.91 0 top
D4  SM4007PL  [SOD-123F_L2.8-W1.8-LS3.7-RD]  23.88 44.2 270 top
F1  39212000000  [FUSE-TH_L8.5-W4.0-P5.08-D0.6]  33.53 18.29 90 top
F2  39214000000  [FUSE-TH_L8.5-W4.0-P5.08-D0.6]  24.89 17.78 270 top
F3  39214000000  [FUSE-TH_L8.5-W4.0-P5.08-D0.6]  6.6 17.78 270 top
K1  G2RL-2-DC12  [RELAY-TH_G2RL-2]  15.75 29.46 270 top
L1  470uH  [IND-TH_BD8.7-P5.0-D0.7_RLB0914]  29.97 28.45 135 top
L2  EE8.3-15mH  [XFMR-TH_4P-L9.5-W9.5_EE8.3-10MH]  40.13 33.53 90 top
Q1  SS8050(RANGE:200-350)  [SOT-23-3_L2.9-W1.3-P1.90-LS2.4-BR]  26.92 44.2 90 top
Q2  SS8050(RANGE:200-350)  [SOT-23-3_L2.9-W1.3-P1.90-LS2.4-BR]  2.29 40.89 0 top
R1  210pF@1kHz  [RES-TH_L12.5-W5.1-P7.50-D1.2-S2.20]  42.67 16.76 0 top
R2  390Ω  [R0805]  2.29 60.45 0 top
R3  10kΩ  [R0805]  6.1 40.13 180 top
R4  10kΩ  [R0805]  26.92 40.64 0 top
U1  TAS20-12-W2  [PWRM-TH_4P-L39.0-W25.0_TAS12-15-W2]  28.96 59.44 180 top
U2  MX5052S  [SOP-8_L4.9-W3.9-P1.27-LS6.0-BL]  3.3 68.07 0 top
U8  DS18B20(UMW)  [TO-92-3_L4.9-W3.7-P1.27-L]  7.11 46.23 90 top

## Footprints (pads in the part's own frame, mm; a bottom-side part is the same pattern mirrored in y, then rotated)
C0805
  rect 1.41x1.35 smd: 1(-1,0) 2(1,0)
CAP-TH_BD8.0-P3.50-D0.6-FD
  round 1.6 hole 1: 1(-1.75,0) 2(1.75,0)
CAP-TH_L6.0-W3.5-P7.50-D1.0
  round 1.6 hole 1: 1(-3.75,0) 2(3.75,0)
CAP-TH_L13.0-W6.0-P10.00-D1.0
  round 2 hole 1.3: 1(-5.08,0) 2(5.08,0)
CONN-SMD_A1002WV-S-4P
  rect 0.6x1.55 smd: 1(1.5,1.251) 2(0.5,1.251) 3(-0.497,1.25) 4(-1.5,1.251)
  rect 1.2x1.8 smd: 5(2.8,-1.251) 6(-2.8,-1.25)
CONN-TH_9P-P5.08_DIBO_DB128V-5.08-9P-GN-S
  rect 2.3x2.3 hole 1.5: 1(-20.32,0)
  round 2.3 hole 1.5: 2(-15.24,0) 3(-10.16,0) 4(-5.08,0) 5(0,0) 6(5.08,0) 7(10.16,0) 8(15.24,0) 9(20.32,0)
FUSE-TH_L8.5-W4.0-P5.08-D0.6
  round 1.8 hole 1: 1(-2.54,0) 2(2.54,0)
IND-TH_BD8.7-P5.0-D0.7_RLB0914
  rect 1.6x1.6 hole 1: 1(-2.5,0)
  round 1.6 hole 1: 2(2.5,0)
PWRM-TH_4P-L39.0-W25.0_TAS12-15-W2
  round 2.2 hole 1.5: 1(-15.7,-5.35) 2(-15.7,5.35) 4(15.7,4) 5(15.7,0) 6(15.7,-4)
R0805
  rect 1.133x1.377 smd: 1(-1,0) 2(1,0)
RELAY-TH_G2RL-2
  round 2.5 hole 1.5: 1(-12.5,-3.751) 2(2.5,-3.751) 3(7.5,-3.751) 4(12.5,-3.751) 5(12.5,3.751) 6(7.5,3.751) 7(2.5,3.751) 8(-12.5,3.751)
RES-TH_L12.5-W5.1-P7.50-D1.2-S2.20
  round 2 hole 1.2: 1(-3.749,1.1) 2(3.749,-1.1)
SMB_L4.3-W3.6-LS5.3-RD
  rect 2.5x2.3 smd: 1(-2.15,0) 2(2.15,0)
SOD-123F_L2.8-W1.8-LS3.7-RD
  rect 1x1.2 smd: 1(-1.65,0) 2(1.65,0)
SOD-123FL_L2.8-W1.8-LS3.8-R-RD
  rect 1.3x1.2 smd: 1(1.65,0) 2(-1.65,0)
SOP-8_L4.9-W3.9-P1.27-LS6.0-BL
  oval 0.63x1.865 smd: 1(-1.905,-2.683) 2(-0.635,-2.683) 3(0.635,-2.683) 4(1.905,-2.683) 5(1.905,2.683) 6(0.635,2.683) 7(-0.635,2.683) 8(-1.905,2.683)
SOT-23-3_L2.9-W1.3-P1.90-LS2.4-BR
  rect 1.25x0.7 smd: 1(1,-0.95) 2(1,0.95) 3(-1,0)
SOT-143-4_L2.9-W1.3-P1.90-LS2.4-BL
  rect 1.194x0.838 smd: 1(-0.75,-1.192)
  rect 0.838x0.838 smd: 2(0.95,-1.192) 3(0.95,1.192) 4(-0.95,1.192)
TO-92-3_L4.9-W3.7-P1.27-L
  rect 0.9x1.6 hole 0.7: 1(-1.27,0)
  oval 0.9x1.6 hole 0.7: 2(0,0) 3(1.27,0)
XFMR-TH_4P-L9.5-W9.5_EE8.3-10MH
  round 1.5 hole 0.9: 1(-2.5,-3.5) 2(2.5,-3.5) 3(2.5,3.5) 4(-2.5,3.5)

## Nets
As in the schematic.

Pads without a net: CN4 5 6; U1 5

## Via types
v1: diameter 0.61, hole 0.305, Top Layer to Bottom Layer, 62 vias

## Routing (per net, layer and track width the routed paths; a pad name or vN(x,y) marks a point on that pad's centre or on a via; arc(x,y) is an arc through that point)
+5V: length 96.9
  Top Layer w0.381: CN4.2 5.08,37.82 v1(5.08,36.07) ; CN1.2 40.23,84.23 39.12,85.34 3.05,85.34 1.84,84.14 D3.4 0.76,74.02 v1(0.76,73.41)
  Bottom Layer w0.381: v1(0.76,73.41) 0.76,51.05 4.32,47.5 5.09,47.5 ; v1(5.08,36.07) 5.08,47.49 5.09,47.5 ; 5.09,47.5 U8.3
+12V: length 89.9
  Top Layer w0.381: v1(13.84,50.4) 13.84,50.39 13.84,45.85 ; 13.84,45.85 D4.1 ; 13.84,45.85 12,44 K1.1 12,39.43 10.4,37.83 CN4.1 ; U2.5 5.84,71.39 v1(5.84,72.64)
  Top Layer w2.032: CN1.5 CN1.6 19.91,77.83 17.78,75.69 12.32,75.69 D2.2 7.38,70.75 U2.5 U2.7 U2.8
  Bottom Layer w0.381: v1(5.84,72.64) 10.16,72.64 15.49,67.31 15.49,52.05 v1(13.84,50.4)
GND: length 22.2
  Top Layer w0.381: 1.52,42.16 1.84,41.84 Q2.2 ; CN4.4 v1(2.03,37.83) ; D2.1 v1(7.62,76.2) ; 6.6,61.72 6.6,61.74 C6.2 6.33,64.01 3.05,64.01 2.67,64.39 U2.2 v1(2.67,67.56) ; D3.1 v1(2.04,73.91) ; C4.1 v1(5.6,58.42) ; Q1.2 v1(25.97,47.24) ; D1.2 v1(2.29,46.23)
  vias: v1(1.56,42.17) v1(3.05,52.32) v1(5.59,56.9) v1(6.6,49.78) v1(9.4,35.58) v1(9.63,56.9) v1(10.67,69.6) v1(12.19,68.07) v1(12.19,47.75) v1(12.19,35.56) v1(13.72,72.14) v1(13.72,52.32) v1(14.73,77.72) v1(14.73,73.66) v1(14.73,35.56) v1(15.24,39.12) v1(15.75,70.1) v1(16.76,51.31) v1(17.08,46.94) v1(17.27,41.15) v1(17.27,35.56) v1(17.78,79.25) v1(17.78,66.04) v1(17.78,62.99) v1(17.78,59.94) v1(17.78,56.39) v1(19.3,53.85) v1(19.52,51.31) v1(19.7,46.94) v1(19.81,44.7) v1(19.84,35.56) v1(21.59,37.34) v1(22.35,79.25) v1(23.37,39.12) v1(27.94,66.04) v1(27.94,62.48) v1(27.94,58.42) v1(27.94,54.86) v1(27.94,51.33) v1(27.94,48.26) v1(30.48,68.58) v1(33.02,71.12) v1(35.56,73.66) v1(39.12,75.18) v1(44.2,75.18)
ACCESS: length 74.6
  Top Layer w0.381: R3.1 7.11,40.15 v1(7.11,42.67) ; CN1.9 4.67,78.84 3.74,77.91 D3.3 v1(5.08,75.11) ; v1(15.24,44.2) 15.24,41.15 16.76,39.62 22.35,39.62 23.37,40.64 R4.1
  Bottom Layer w0.381: v1(5.08,75.11) 8.71,75.11 16.26,67.56 16.26,54.86 18.29,52.83 18.29,45.72 16.76,44.2 v1(15.24,44.2) 8.64,44.2 v1(7.11,42.67)
COM1: length 19.3
  Top Layer w2.032: CN2.5 24.89,5.74 F2.2
  Bottom Layer w2.032: F2.2 24.89,5.74 CN2.5
COM2: length 21.8
  Top Layer w2.032: CN2.2 9.75,7.26 6.6,10.41 F3.2
  Bottom Layer w2.032: CN2.2 9.75,7.26 6.6,10.41 F3.2
EARTH: length 48.2
  Bottom Layer w1.016: CN2.9 45.31,11.81 42.91,14.21 42.91,23.49 ; C2.1 41.87,40.64 39.89,38.66 39.89,26.51 42.91,23.49 ; 42.91,23.49 45.31,25.89 45.31,27.34 C3.2
LIVE: length 21.6
  Top Layer w2.032: F1.1 33.53,10.67 35.15,9.04 CN2.7
  Bottom Layer w2.032: F1.1 33.53,10.67 35.15,9.04 CN2.7
NC1: length 57.1
  Top Layer w2.032: CN2.6 29.21,6.5 29.21,22.1 24.34,26.96 K1.7
  Bottom Layer w2.032: CN2.6 29.21,6.5 29.21,22.1 24.34,26.96 K1.7
NC2: length 62.3
  Top Layer w2.032: CN2.1 2.03,8.28 2.03,24.89 4.1,26.96 K1.2
  Bottom Layer w2.032: CN2.1 2.03,8.28 2.03,24.89 4.1,26.96 K1.2
NEUTRAL: length 32.4
  Top Layer w2.032: 43.43,30.82 42.67,30.07 42.67,25.65 44.96,23.37 C1.1 47.75,17 R1.2 40.23,9.48 CN2.8
NO1: length 23
  Top Layer w2.032: CN2.4 19.91,16.55 K1.5
  Bottom Layer w2.032: CN2.4 19.91,16.55 K1.5
NO2: length 25
  Top Layer w2.032: K1.4 12,13.4 14.83,10.57 CN2.3
  Bottom Layer w2.032: CN2.3 14.83,10.57 12,13.4 K1.4
ONEWIRE: length 45.3
  Top Layer w0.381: CN1.8 6.1,77.6 6.1,74.17 4.65,72.72 D3.2 v1(3.74,73.91) ; U8.2 6.1,46.23 5.59,46.74 v1(5.59,48.26)
  Bottom Layer w0.381: v1(5.59,48.26) 4.24,48.26 1.25,51.25 1.25,70.84 3.74,73.34 v1(3.74,73.91)
$1N1976: length 42.7
  Top Layer w0.381: R2.1 v1(2.81,61.98)
  Top Layer w2.032: 10.16,63.23 10.16,64.52 9.14,65.53 4.32,65.53 ; 10.16,63.23 13.05,63.23 U1.6 ; 10.16,63.23 10.16,61.47 9.14,60.45 C4.2 7.6,55.89 C5.1 6.32,52.67 D1.1
  Bottom Layer w0.381: v1(2.81,61.98) 11.8,61.98 U1.6
$1N1978: length 58.9
  Top Layer w2.032: L2.3 36.63,40.38 C2.2 38.1,41.85 38.1,58.23 U1.1
  Bottom Layer w2.032: 38.1,44.7 38.1,41.85 C2.2 ; 38.1,45.21 38.1,58.23 U1.1
$1N1980: length 9.3
  Top Layer w0.381: R2.2 3.32,60.45 C6.1 4.84,63.5 2.03,63.5 1.4,64.14 U2.1
$1N1987: length 46.2
  Top Layer w2.032: U1.2 48.21,50.54 48.21,37.73 C3.1 46.5,36.03 L2.2
  Bottom Layer w2.032: L2.2 46.5,36.03 C3.1 48.21,37.73 48.21,50.54 U1.2
$1N3331: length 8.1
  Top Layer w0.381: Q1.3 26.92,42.93 26.54,42.55 D4.2 23.29,41.96 K1.8
$1N4248: length 1.9
  Top Layer w0.381: Q2.1 4.91,39.94 R3.2
$1N4287: length 4.6
  Top Layer w0.381: Q1.1 27.92,45.15 R4.2
$1N4344: length 8.1
  Top Layer w0.381: CN4.3 4.07,37.09 3.56,36.58 1.52,36.58 1.12,36.98 1.12,40.73 Q2.3
$1N5641: length 12.1
  Top Layer w2.032: F2.1 23.25,21.96 K1.6
  Bottom Layer w2.032: K1.6 23.25,21.96 F2.1
$1N5654: length 12.1
  Top Layer w2.032: F3.1 8.25,21.96 K1.3
  Bottom Layer w2.032: K1.3 8.25,21.96 F3.1
$1N6319: length 18
  Top Layer w2.032: 35.96,20.83 R1.1 ; 35.96,20.83 F1.2 ; 35.96,20.83 37.59,22.46 C1.2 37.59,24.89 35.8,26.68 L1.1
$1N6320: length 8.8
  Top Layer w2.032: L1.2 29.02,31.03 L2.4

## Copper pours and planes (outline as drawn; the poured copper is in the pictures)
GND on Top Layer: -2.54,91.95 57.91,91.95 57.91,33.53 -2.54,33.53
GND on Bottom Layer: -4.57,89.92 58.93,89.92 58.93,29.97 -4.57,29.97

## Text on the board
Top Silkscreen Layer: G A 5 12 | Ver 3.0.0 | ACS DIN Switch | April 2026

# Board PCB2
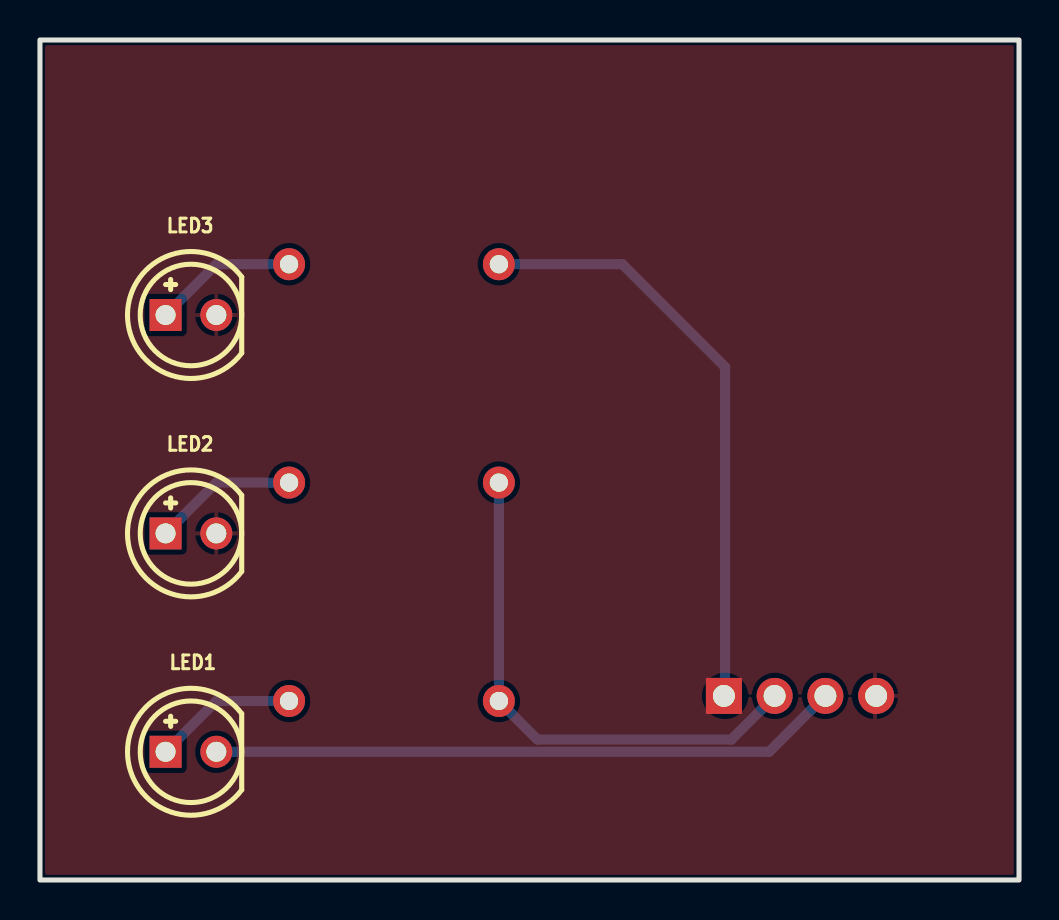
[diagram p4: board, top side]
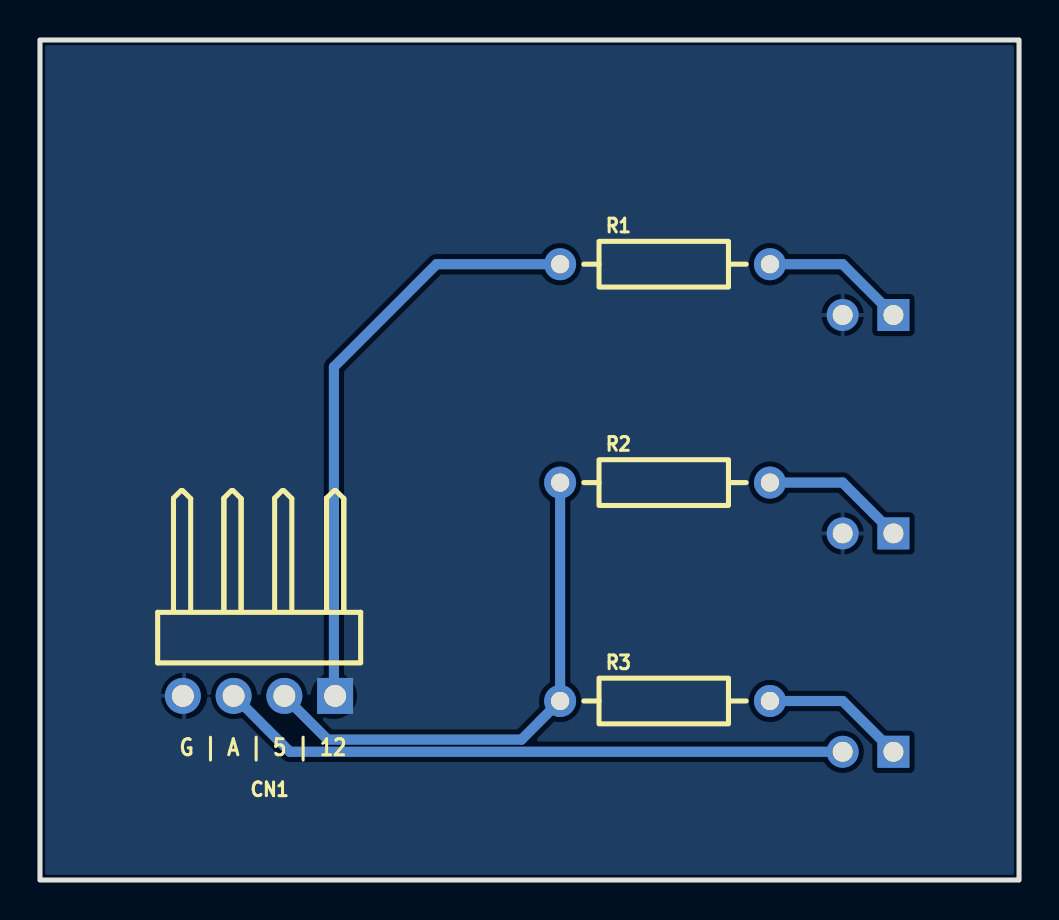
[diagram p5: board, bottom side, seen from below]

Outline 49 x 42.01 mm; copper layers: Top Layer, Bottom Layer. Coordinates in mm from the lower left corner of the outline.
Outline path: rectangle 0,0 49,42.01
Stack: Top Layer 0.035mm / Dielectric1 1.51mm FR4 er 4.5 / Bottom Layer 0.035mm

## Design rules (mm)
template: JLCPCB Capability(Two Layers Board)
spacing copperThickness1oz (default): track to track 0.102, other pairs 0.152 to 0.3
spacing copperThickness2oz: track to track 0.203, other pairs 0.152 to 0.3
track width copperThickness1oz (default): min 0.127, default 0.254, max 2.54
track width copperThickness2oz: min 0.203, default 0.254, max 2.54
differential pair differentialPair (default): width min 0.127, default 0.254, max 2.54; gap min 0.152, default 0.152
via viaSize (default): diameter min 0.5, default 0.61, max 10; hole min 0.3, default 0.305, max 6.3

## Placement (name value [footprint] x y rotation side)
CN1  2541WR-04P  [HDR-TH_4P-P2.54-H-M-W10.4-N]  38.04 9.21 0 bottom
LED1  TJ-L5FYTGCRTFCSFLC2R-A5  [LED-TH_BD5.8-P2.54-FD]  7.56 6.41 0 top
LED2  TJ-L5FYTGCRTFCSFLC2R-A5  [LED-TH_BD5.8-P2.54-FD]  7.56 17.34 0 top
LED3  TJ-L5FYTGCRTFCSFLC2R-A5  [LED-TH_BD5.8-P2.54-FD]  7.56 28.26 0 top
R1  4.7kΩ  [RES-TH_BD2.2-L6.5-P10.50-D0.6]  17.72 30.8 0 bottom
R2  1kΩ  [RES-TH_BD2.2-L6.5-P10.50-D0.6]  17.72 19.88 0 bottom
R3  1kΩ  [RES-TH_BD2.2-L6.5-P10.50-D0.6]  17.72 8.95 0 bottom

## Footprints (pads in the part's own frame, mm; a bottom-side part is the same pattern mirrored in y, then rotated)
HDR-TH_4P-P2.54-H-M-W10.4-N
  rect 1.8x1.8 hole 1.1: 1(-3.81,0)
  round 1.8 hole 1.1: 2(-1.27,0) 3(1.27,0) 4(3.81,0)
LED-TH_BD5.8-P2.54-FD
  rect 1.6x1.6 hole 1: 1(-1.27,0)
  round 1.6 hole 1: 2(1.27,0)
RES-TH_BD2.2-L6.5-P10.50-D0.6
  round 1.6 hole 0.914: 1(-5.25,0) 2(5.25,0)

## Nets
As in the schematic.

## Routing (per net, layer and track width the routed paths; a pad name or vN(x,y) marks a point on that pad's centre or on a via; arc(x,y) is an arc through that point)
+5V: length 26.4
  Bottom Layer w0.508: R2.2 R3.2 24.9,7.02 34.6,7.02 36.79,9.21
+12V: length 29.9
  Bottom Layer w0.508: 34.29,9.21 34.29,25.66 29.15,30.8 R1.2
ACCESS-LED: length 31.6
  Bottom Layer w0.508: LED1.2 36.49,6.41 39.28,9.21
$1N574: length 7.2
  Bottom Layer w0.508: R1.1 8.83,30.8 LED3.1
$1N582: length 7.2
  Bottom Layer w0.508: R2.1 8.83,19.88 LED2.1
$1N622: length 7.2
  Bottom Layer w0.508: R3.1 8.83,8.95 LED1.1

## Copper pours and planes (outline as drawn; the poured copper is in the pictures)
GND on Top Layer: -1.59,44.77 52.77,44.77 52.77,-4 -1.59,-4
GND on Bottom Layer: -1.59,44.77 52.26,44.77 52.26,-5.52 -1.59,-5.52

## Text on the board
Bottom Silkscreen Layer: G | A | 5 | 12
